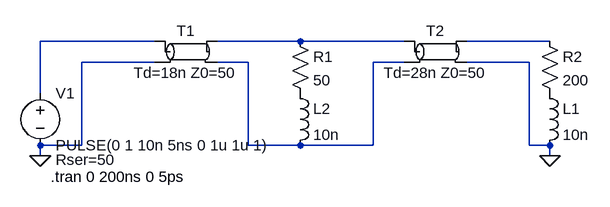
[diagram p0: schematic p2.match_sim.asc]
p2.match_sim.asc, the LTspice schematic file:
Version 4
SHEET 1 900 680
WIRE 208 224 32 224
WIRE 432 224 304 224
WIRE 592 224 432 224
WIRE 816 224 688 224
WIRE 208 256 96 256
WIRE 352 256 304 256
WIRE 592 256 544 256
WIRE 784 256 688 256
WIRE 32 304 32 224
WIRE 96 384 96 256
WIRE 96 384 32 384
WIRE 352 384 352 256
WIRE 432 384 352 384
WIRE 544 384 544 256
WIRE 544 384 432 384
WIRE 784 384 784 256
WIRE 816 384 784 384
WIRE 32 400 32 384
WIRE 816 400 816 384
FLAG 32 400 0
FLAG 816 400 0
SYMBOL tline 256 240 R0
SYMATTR InstName T1
SYMATTR Value Td=18n Z0=50
SYMBOL tline 640 240 R0
SYMATTR InstName T2
SYMATTR Value Td=28n Z0=50
SYMBOL Voltage 32 288 R0
WINDOW 39 24 118 Left 2
SYMATTR SpiceLine Rser=50
SYMATTR InstName V1
SYMATTR Value PULSE(0 1 10n 5ns 0 1u 1u 1)
SYMBOL Res 416 208 R0
SYMATTR InstName R1
SYMATTR Value 50
SYMBOL Res 800 208 R0
SYMATTR InstName R2
SYMATTR Value 200
SYMBOL Ind 800 288 R0
SYMATTR InstName L1
SYMATTR Value 10n
SYMBOL Ind 416 288 R0
SYMATTR InstName L2
SYMATTR Value 10n
TEXT 48 432 Left 2 !.tran 0 200ns 0 5ps

The netlist it stands for:
* p2.match_sim.asc
T1 N001 0 N002 N004 Td=18n Z0=50
T2 N002 N004 N003 0 Td=28n Z0=50
V1 N001 0 PULSE(0 1 10n 5ns 0 1u 1u 1) Rser=50
R1 N002 P001 50
R2 N003 P002 200
L1 P002 0 10n
L2 P001 N004 10n
.tran 0 200ns 0 5ps
.backanno
.end